# Altium project ST-Link-V2.2.PrjPcb
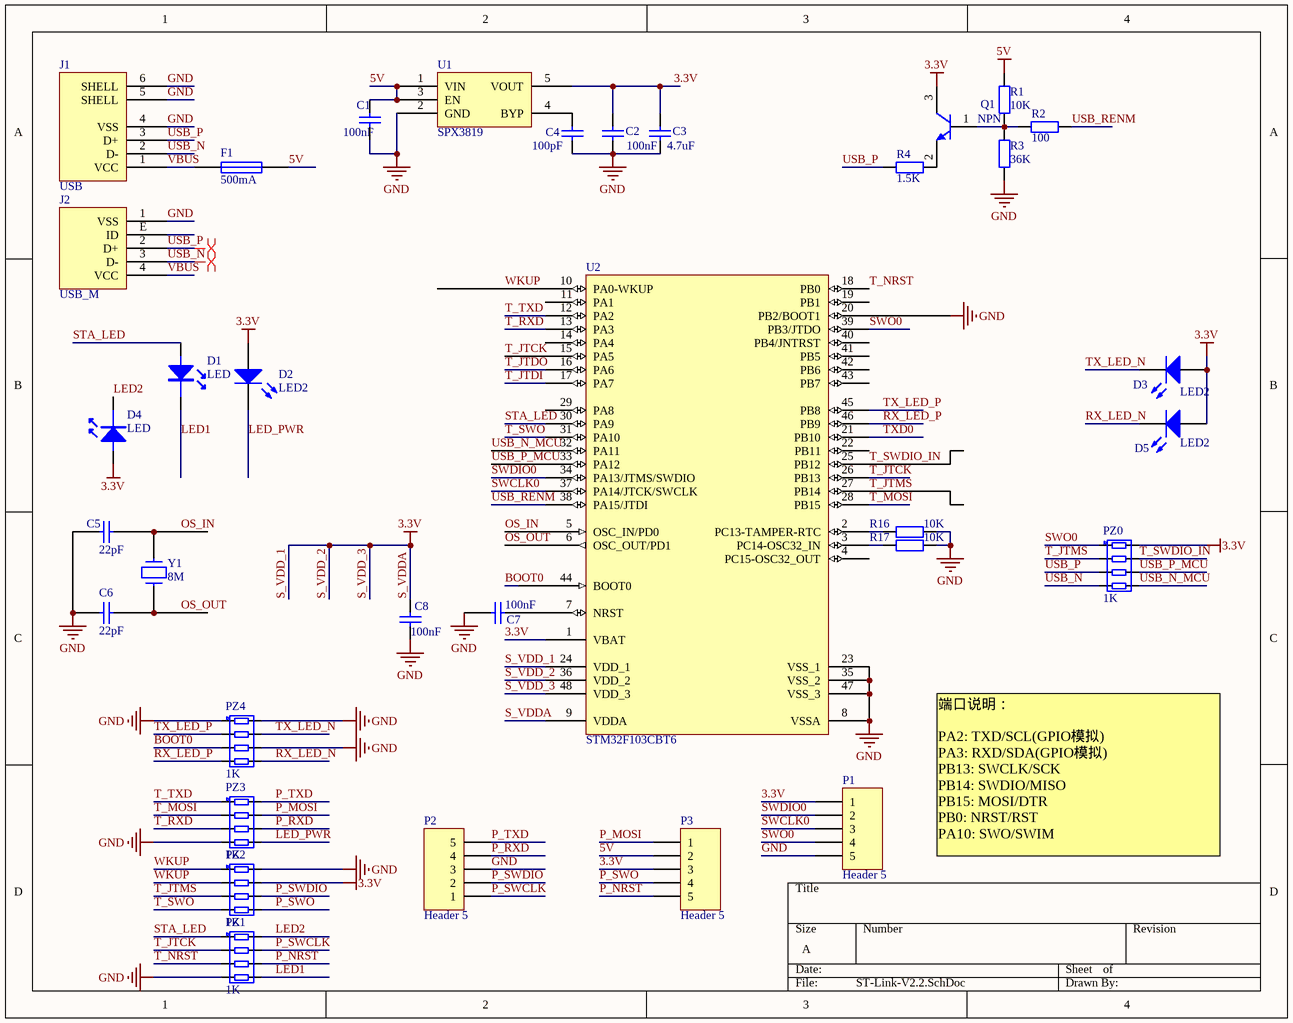
[diagram p0: ST-Link-V2.2.SchDoc]
1 sheet, 34 parts. Net scope: global (net labels, ports and power ports of the same name join across sheets).
Board file: ST-Link-V2.2.PcbDoc

## Sheet ST-Link-V2.2.SchDoc
size A

### Parts
C1  value 100nF  [C-0603]  (hidden comment: Cap)
C2  value 100nF  [C-0603]  (hidden comment: Cap)
C3  value 4.7uF  [C-0603]  (hidden comment: Cap)
C4  value 100pF  [C-0603]  (hidden comment: Cap)
C5  value 22pF  [C-0603]  (hidden comment: Cap)
C6  value 22pF  [C-0603]  (hidden comment: Cap)
C7  value 100nF  [C-0603]  (hidden comment: Cap)
C8  value 100nF  [C-0603]  (hidden comment: Cap)
D1  LED  [SMT_LED_0603]
D2  LED2  [SMT_LED_0603]
D3  LED2  [SMT_LED_0603]
D4  LED  [SMT_LED_0603]
D5  LED2  [SMT_LED_0603]
F1  value 500mA  [0805-1]  (hidden comment: Fuse1)
J1  USB  [USB-B]
J2  USB_M  [USB_MICRO_5S_B]
P1  Header 5  [SIP5-1.27]
P2  Header 5  [HEADER 5]
P3  Header 5  [HEADER 5]
PZ0  1K  [AR0603*4]
PZ1  1K  [AR0603*4]
PZ2  1K  [AR0603*4]
PZ3  1K  [AR0603*4]
PZ4  1K  [AR0603*4]
Q1  NPN  [SOT23-3]
R1  value 10K  [0603-1]  (hidden comment: Res1)
R2  value 100  [0603-1]  (hidden comment: Res1)
R3  value 36K  [0603-1]  (hidden comment: Res1)
R4  value 1.5K  [0603-1]  (hidden comment: Res1)
R16  value 10K  [0603-1]  (hidden comment: Res1)
R17  value 10K  [0603-1]  (hidden comment: Res1)
U1  SPX3819  [SOT23-5]
U2  STM32F103CBT6  [LQFP48_N]
Y1  8M  [XAL5032 2-Leads]

### Nets
3.3V: C2.2 C3.2 C8.2 D2.1(A) D3.1(A) D4.1(A) D5.1(A) P1.1 P3.3 PZ0.8 PZ2.7 Q1.3(C) U1.5(VOUT) U2.1(VBAT) U2.9(VDDA) U2.24(VDD_1) U2.36(VDD_2) U2.48(VDD_3)  [also labelled S_VDD_1, S_VDD_2, S_VDD_3, S_VDDA]
5V: C1.2 F1.1 P3.2 R1.1 U1.1(VIN) U1.3(EN)
GND: C1.1 C2.1 C3.1 C4.1 C5.1 C6.1 C7.1 C8.1 J1.4(VSS) J1.5(SHELL) J1.6(SHELL) J2.1(VSS) P1.5 P2.3 PZ1.4 PZ2.8 PZ3.4 PZ4.1 PZ4.6 PZ4.8 R3.2 R16.2 R17.2 U1.2(GND) U2.8(VSSA) U2.20(PB2/BOOT1) U2.23(VSS_1) U2.35(VSS_2) U2.47(VSS_3)
BOOT0: PZ4.3 U2.44(BOOT0)
LED1: D1.2(K) PZ1.5
LED2: D4.2(K) PZ1.8
LED_PWR: D2.2(K) PZ3.5
OS_IN: C5.2 U2.5(OSC_IN/PD0) Y1.2
OS_OUT: C6.2 U2.6(OSC_OUT/PD1) Y1.1
P_MOSI: P3.1 PZ3.7
P_NRST: P3.5 PZ1.6
P_RXD: P2.4 PZ3.6
P_SWCLK: P2.1 PZ1.7
P_SWDIO: P2.2 PZ2.6
P_SWO: P3.4 PZ2.5
P_TXD: P2.5 PZ3.8
RX_LED_N: D5.2(K) PZ4.5
RX_LED_P: PZ4.4 U2.46(PB9)
STA_LED: D1.1(A) PZ1.1 U2.30(PA9)
SWCLK0: P1.3 U2.37(PA14/JTCK/SWCLK)
SWDIO0: P1.2 U2.34(PA13/JTMS/SWDIO)
SWO0: P1.4 PZ0.1 U2.39(PB3/JTDO)
T_JTCK: PZ1.2 U2.15(PA5) U2.26(PB13)
T_JTDI: U2.17(PA7)
T_JTDO: U2.16(PA6)
T_JTMS: PZ0.2 PZ2.3 U2.27(PB14)
T_MOSI: PZ3.2 U2.28(PB15)
T_NRST: PZ1.3 U2.18(PB0)
T_RXD: PZ3.3 U2.13(PA3)
T_SWDIO_IN: PZ0.7 U2.25(PB12)
T_SWO: PZ2.4 U2.31(PA10)
T_TXD: PZ3.1 U2.12(PA2)
TX_LED_N: D3.2(K) PZ4.7
TX_LED_P: PZ4.2 U2.45(PB8)
TXD0: U2.21(PB10)
USB_N: J1.2(D-) J2.3(D-) PZ0.4
USB_N_MCU: PZ0.5 U2.32(PA11)
USB_P: J1.3(D+) J2.2(D+) PZ0.3 R4.2
USB_P_MCU: PZ0.6 U2.33(PA12)
USB_RENM: R2.2 U2.38(PA15/JTDI)
VBUS: F1.2 J1.1(VCC) J2.4(VCC)
WKUP: PZ2.1 PZ2.2 U2.10(PA0-WKUP)
NetC4_2: C4.2 U1.4(BYP)
NetC7_2: C7.2 U2.7(NRST)
NetQ1_1: Q1.1(B) R1.2 R2.1 R3.1
NetQ1_2: Q1.2(E) R4.1
NetR16_1: R16.1 U2.2(PC13-TAMPER-RTC)
NetR17_1: R17.1 U2.3(PC14-OSC32_IN)

Not connected (* = marked no-connect by the designer): J2 E(ID); U2 4(PC15-OSC32_OUT) 11(PA1) 14(PA4) 19(PB1) 22(PB11) 29(PA8) 40(PB4/JNTRST) 41(PB5) 42(PB6) 43(PB7)

### Layout directives
differential pair: USB_N, USB_P

### Notes on the sheet
- 端口说明：
  PA2: TXD/SCL(GPIO模拟)
  PA3: RXD/SDA(GPIO模拟)
  PB13: SWCLK/SCK
  PB14: SWDIO/MISO
  PB15: MOSI/DTR
  PB0: NRST/RST
  PA10: SWO/SWIM

### Library data of the parts
C1-C4 C8 = Cap: Capacitor; Published: 8-Jun-2000; LatestRevisionDate: 17-Jul-2002; LatestRevisionNote: Re-released for DXP Platform.; PackageReference: RAD-0.3; Publisher: Altium Limited; PackageDescription: Radial Cap, Thru-Hole; 2 Leads; 0.3 in Pin Spacing
D1 D4 = LED: LED 发光二极管
D2 D3 D5 = LED2: Typical RED, GREEN, YELLOW, AMBER GaAs LED; Published: 8-Jun-2000; LatestRevisionDate: 17-Jul-2002; LatestRevisionNote: Re-released for DXP Platform.; PackageVersion: Feb-2002; PackageReference: 3.2X1.6X1.1; Publisher: Altium Limited; PackageDescription: SM LED; 2 Flat Leads
F1 = Fuse1: 保险丝
J1 = USB: USB接口
J2 = USB_M: Micro/Mini USB
P1-P3 = Header 5: Header, 5-Pin; LatestRevisionDate: 17-Jul-2002; LatestRevisionNote: Re-released for DXP Platform.; Publisher: Altium Limited
PZ0-PZ4 = RES4R
Q1 = NPN1: 贴片三极管; Published: 8-Jun-2000; LatestRevisionDate: 15-Jan-2003; LatestRevisionNote: PCB Footprint 'BCY-W3/D4.7' replaced; DatasheetDocument: 1997; PackageDocument: Sep-1998; PackageReference: TO-92A; Publisher: Altium Limited; Code_JEDEC: TO-92A; ComponentLink1Description: Manufacturer Link; ComponentLink1URL: http://www.fairchildsemi.com/; ComponentLink2Description: Datasheet; ComponentLink2URL: http://www.fairchildsemi.com/ds/2N%2F2N3904.pdf
R1-R4 R16 R17 = Res1: 贴片电阻; Published: 8-Jun-2000; LatestRevisionDate: 17-Jul-2002; LatestRevisionNote: Re-released for DXP Platform.; PackageReference: AXIAL-0.4; Publisher: Altium Limited
U2 = STM32F103C8T6: STM32 ARM-based 32-bit MCU with 64 Kbytes Flash, 48-pin LQFP, Industrial Temperature; Published: 30-May-2008; DatasheetVersion: rev6, Mar-2008; PackageVersion: Mar-2008; PackageReference: LQFP48; Publisher: Altium Limited; PackageDescription: 48-Pin Low-Profile Quad Flat Pack, 7 x 7 mm Body, 0.5 mm Pitch (LQFP48); ComponentLink1Description: Manufacturer Link; ComponentLink1URL: www.st.com/stm32; ComponentLink2Description: Datasheet; ComponentLink2URL: http://www.st.com/stonline/products/literature/ds/13587.pdf
Y1 = XTAL